# EAGLE design Solarduino_V0.4 (EAGLE 7.5.0)

## Sheet 1 of 2
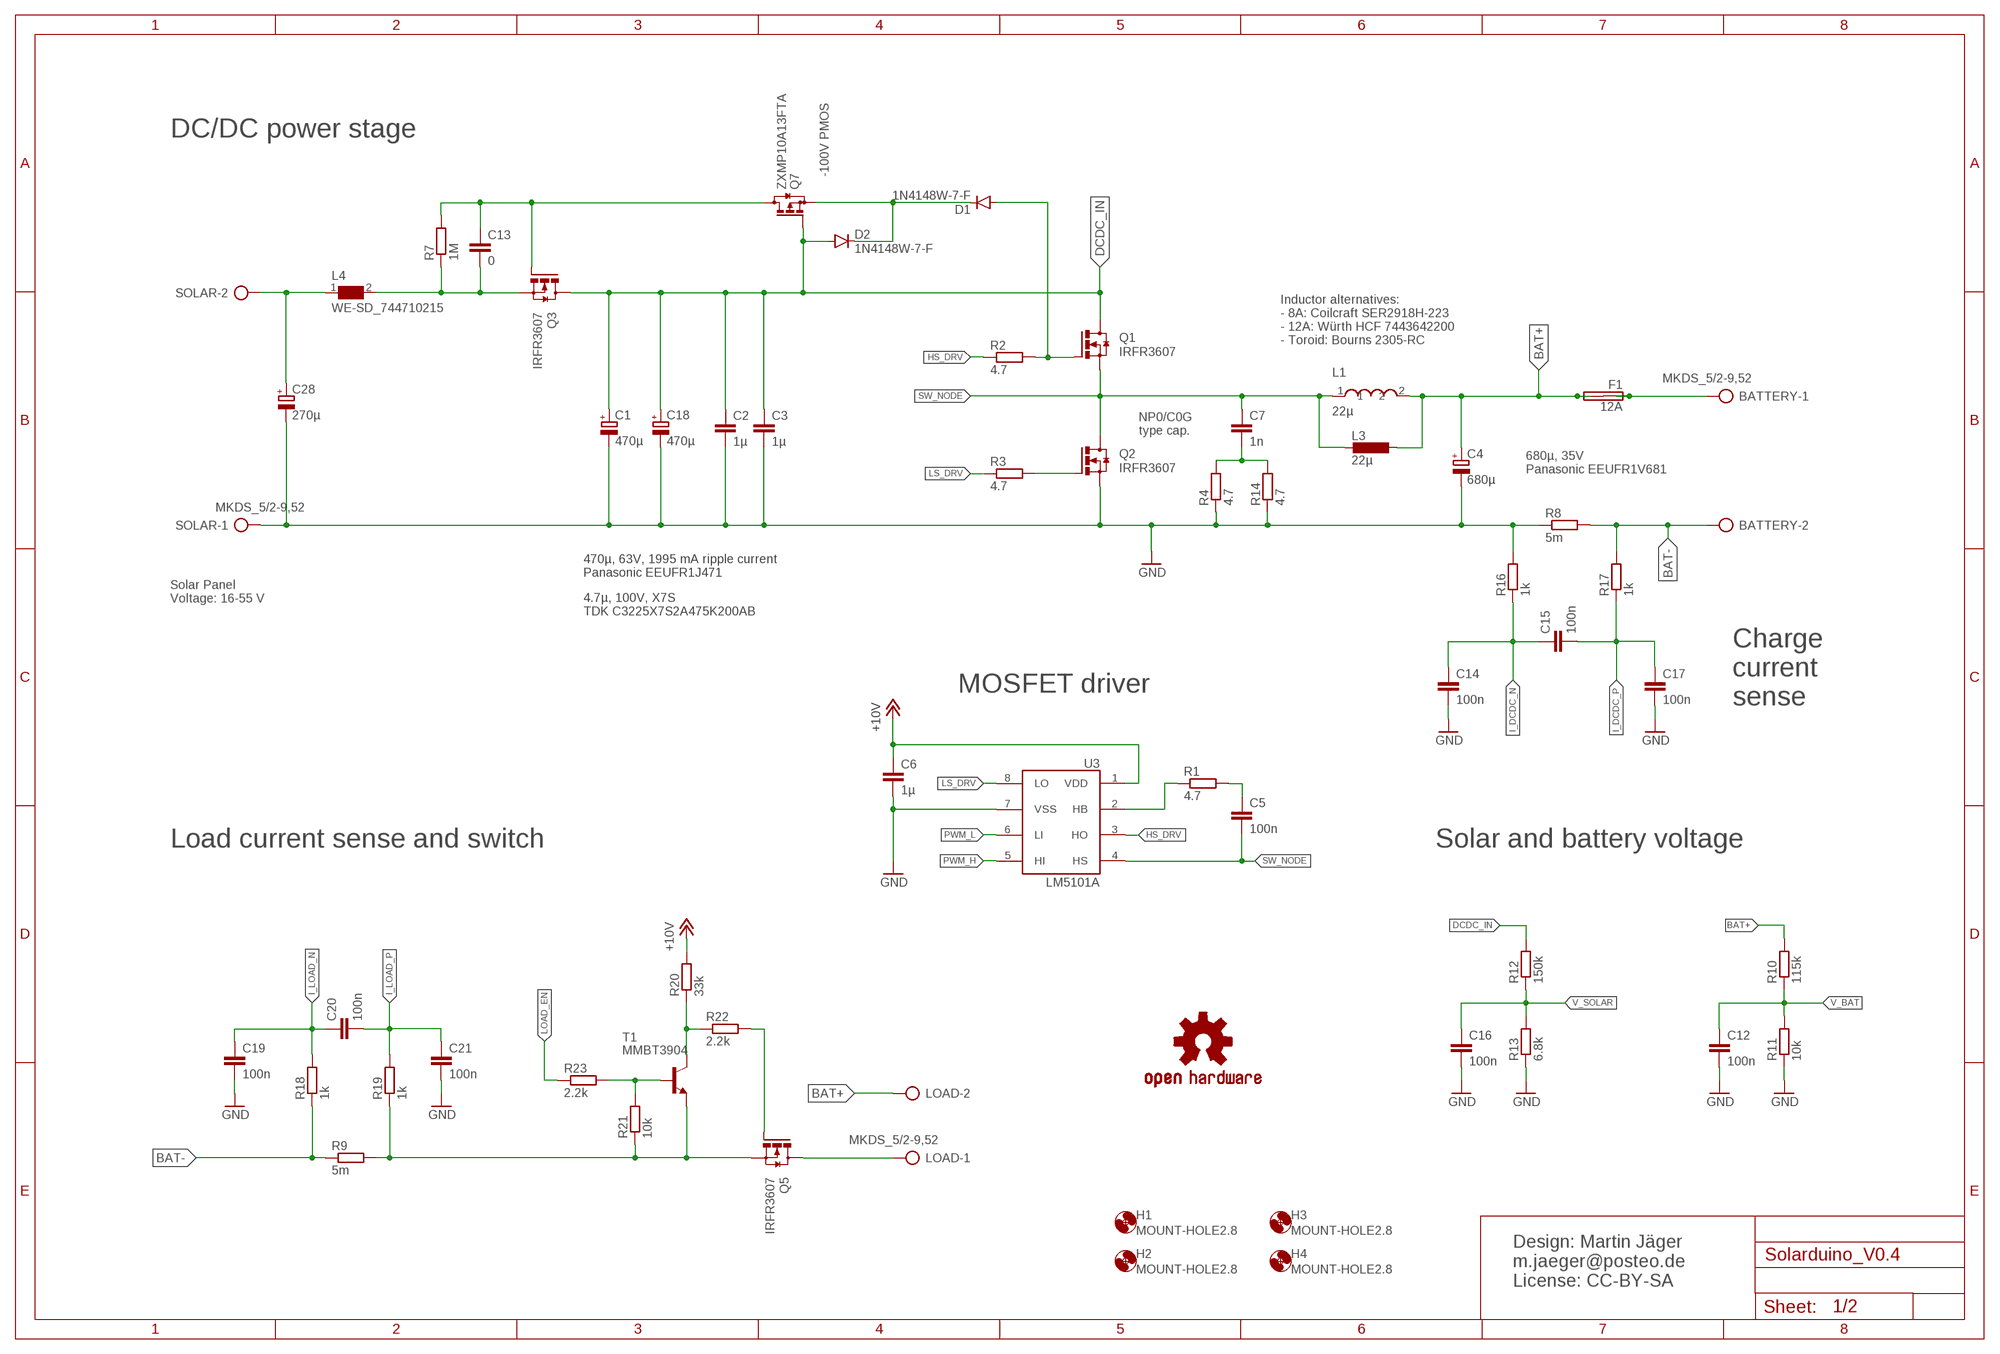
[diagram p0: schematic, sheet 1]

### Parts
BATTERY  MKDS_5/2-9,52  [MKDS_5/2-952]
C1  470µ  CPOL-EUE5-13  [E5-13]
C2  1µ  C-EUC0805  [C0805]
C3  1µ  C-EUC0805  [C0805]
C4  680µ  CPOL-EUE5-10.5  [E5-10,5]
C5  100n  C-EUC0603  [C0603]
C6  1µ  C-EUC0603  [C0603]
C7  1n  C-EUC0805  [C0805]
C12  100n  C-EUC0603  [C0603]
C13  0  C-EUC0603  [C0603]
C14  100n  C-EUC0603  [C0603]
C15  100n  C-EUC0603  [C0603]
C16  100n  C-EUC0603  [C0603]
C17  100n  C-EUC0603  [C0603]
C18  470µ  CPOL-EUE5-13  [E5-13]
C19  100n  C-EUC0603  [C0603]
C20  100n  C-EUC0603  [C0603]
C21  100n  C-EUC0603  [C0603]
C28  270µ  CPOL-EUE5-10.5  [E5-10,5]
D1  1N4148W-7-F  DIODESOD123  [SOD-123]
D2  1N4148W-7-F  DIODESOD123  [SOD-123]
F1  12A  FUSE_BLADE_STD  [BLADE_FUSE_STD]
H1  MOUNT-HOLE2.8  [2,8]
H2  MOUNT-HOLE2.8  [2,8]
H3  MOUNT-HOLE2.8  [2,8]
H4  MOUNT-HOLE2.8  [2,8]
L1  22µ  WE-HCF_2818_7443643300  [WE-HCF_2818_7443643300]
L3  22µ  L-BOURNS2300-H  [L-BOURNS-2300-H]
L4  WE-SD_744710215  [WE-SD_744710215]
LOAD  MKDS_5/2-9,52  [MKDS_5/2-952]
N1  OSHW-LOGOM  [OSHW-LOGO-M]
Q1  IRFR3607  MOSFET_N_DPAK  [DPAK]
Q2  IRFR3607  MOSFET_N_DPAK  [DPAK]
Q3  IRFR3607  MOSFET_N_DPAK  [DPAK]
Q5  IRFR3607  MOSFET_N_DPAK  [DPAK]
Q7  ZXMP10A13FTA  BSS84  [SOT23]
R1  4.7  R-EU_R0805  [R0805]
R2  4.7  R-EU_R0805  [R0805]
R3  4.7  R-EU_R0805  [R0805]
R4  4.7  R-EU_R1206  [R1206]
R7  1M  R-EU_R0603  [R0603]
R8  5m  R-EU_R2512  [R2512]
R9  5m  R-EU_R2512  [R2512]
R10  115k  R-EU_R0603  [R0603]
R11  10k  R-EU_R0603  [R0603]
R12  150k  R-EU_R0603  [R0603]
R13  6.8k  R-EU_R0603  [R0603]
R14  4.7  R-EU_R1206  [R1206]
R16  1k  R-EU_R0603  [R0603]
R17  1k  R-EU_R0603  [R0603]
R18  1k  R-EU_R0603  [R0603]
R19  1k  R-EU_R0603  [R0603]
R20  33k  R-EU_R0603  [R0603]
R21  10k  R-EU_R0603  [R0603]
R22  2.2k  R-EU_R0603  [R0603]
R23  2.2k  R-EU_R0603  [R0603]
SOLAR  MKDS_5/2-9,52  [MKDS_5/2-952]
T1  MMBT3904  MMBT3904LT1-NPN-SOT23-BEC  [SOT23-BEC]
U3  LM5101A  [SOIC-8-N]

### Nets
+10V [VIN]: C6.1 R20.2 U3.1(VDD) ; also sheet 2
BAT+ [VIN]: C4.+ F1.P$3(2A) F1.P$4(2B) L1.2 L3.P$1 LOAD.2 R10.2 ; also sheet 2
BAT-: BATTERY.2 R8.2 R9.1 R17.2 R18.1
DCDC_IN: C1.+ C2.1 C3.1 C18.+ D2.A Q1.4(D) Q3.4(D) Q7.1(G) R12.2
FUSE+ [VIN]: BATTERY.1 F1.P$1(1A) F1.P$2(1B)
GND: C1.- C2.2 C3.2 C4.- C6.2 C12.2 C14.2 C16.2 C17.2 C18.- C19.2 C21.2 C28.- Q2.3(S) R4.1 R8.1 R11.1 R13.1 R14.1 R16.2 SOLAR.1 U3.7(VSS) ; also sheet 2
HS_DRV: R2.1 U3.3(HO)
I_DCDC_N: C14.1 C15.1 R16.1 ; also sheet 2
I_DCDC_P: C15.2 C17.1 R17.1 ; also sheet 2
I_LOAD_N: C19.1 C20.1 R18.2 ; also sheet 2
I_LOAD_P: C20.2 C21.1 R19.2 ; also sheet 2
LC_OUT: C13.2 L4.2 Q3.3(S) R7.1
LOAD-: LOAD.1 Q5.4(D)
LOAD_EN: R23.1 ; also sheet 2
LOAD_G: Q5.1(G) R22.2
LS_DRV: R3.1 U3.8(LO)
N$1: R1.1 U3.2(HB)
N$2: C5.1 R1.2
N$4: D1.A Q1.1(G) R2.2
N$6 [power]: Q5.3(S) R9.2 R19.1 R21.1 T1.E
N$8: C13.1 Q3.1(G) Q7.3(D) R7.2
N$9: Q2.1(G) R3.2
N$10: D1.C D2.C Q7.2(S)
N$11: R20.1 R22.1 T1.C
N$12: C7.2 R4.2 R14.2
N$24: R21.2 R23.2 T1.B
PWM_H: U3.5(HI) ; also sheet 2
PWM_L: U3.6(LI) ; also sheet 2
SOLAR+: C28.+ L4.1 SOLAR.2
SW_NODE: C5.2 C7.1 L1.1 L3.P$2 Q1.3(S) Q2.4(D) U3.4(HS)
V_BAT: C12.1 R10.1 R11.2 ; also sheet 2
V_SOLAR: C16.1 R12.1 R13.2 ; also sheet 2

### Notes on the sheet
- DC/DC power stage
- -100V PMOS
- Inductor alternatives:
  - 8A: Coilcraft SER2918H-223
  - 12A: Würth HCF 7443642200
  - Toroid: Bourns 2305-RC
- NP0/C0G
  type cap.
- 680µ, 35V
  Panasonic EEUFR1V681
- 470µ, 63V, 1995 mA ripple current
  Panasonic EEUFR1J471
- Solar Panel
  Voltage: 16-55 V
- 4.7µ, 100V, X7S
  TDK C3225X7S2A475K200AB
- MOSFET driver
- Charge
  current
  sense
- Load current sense and switch | Solar and battery voltage
- Design: Martin Jäger
  m.jaeger@posteo.de
  License: CC-BY-SA

## Sheet 2 of 2
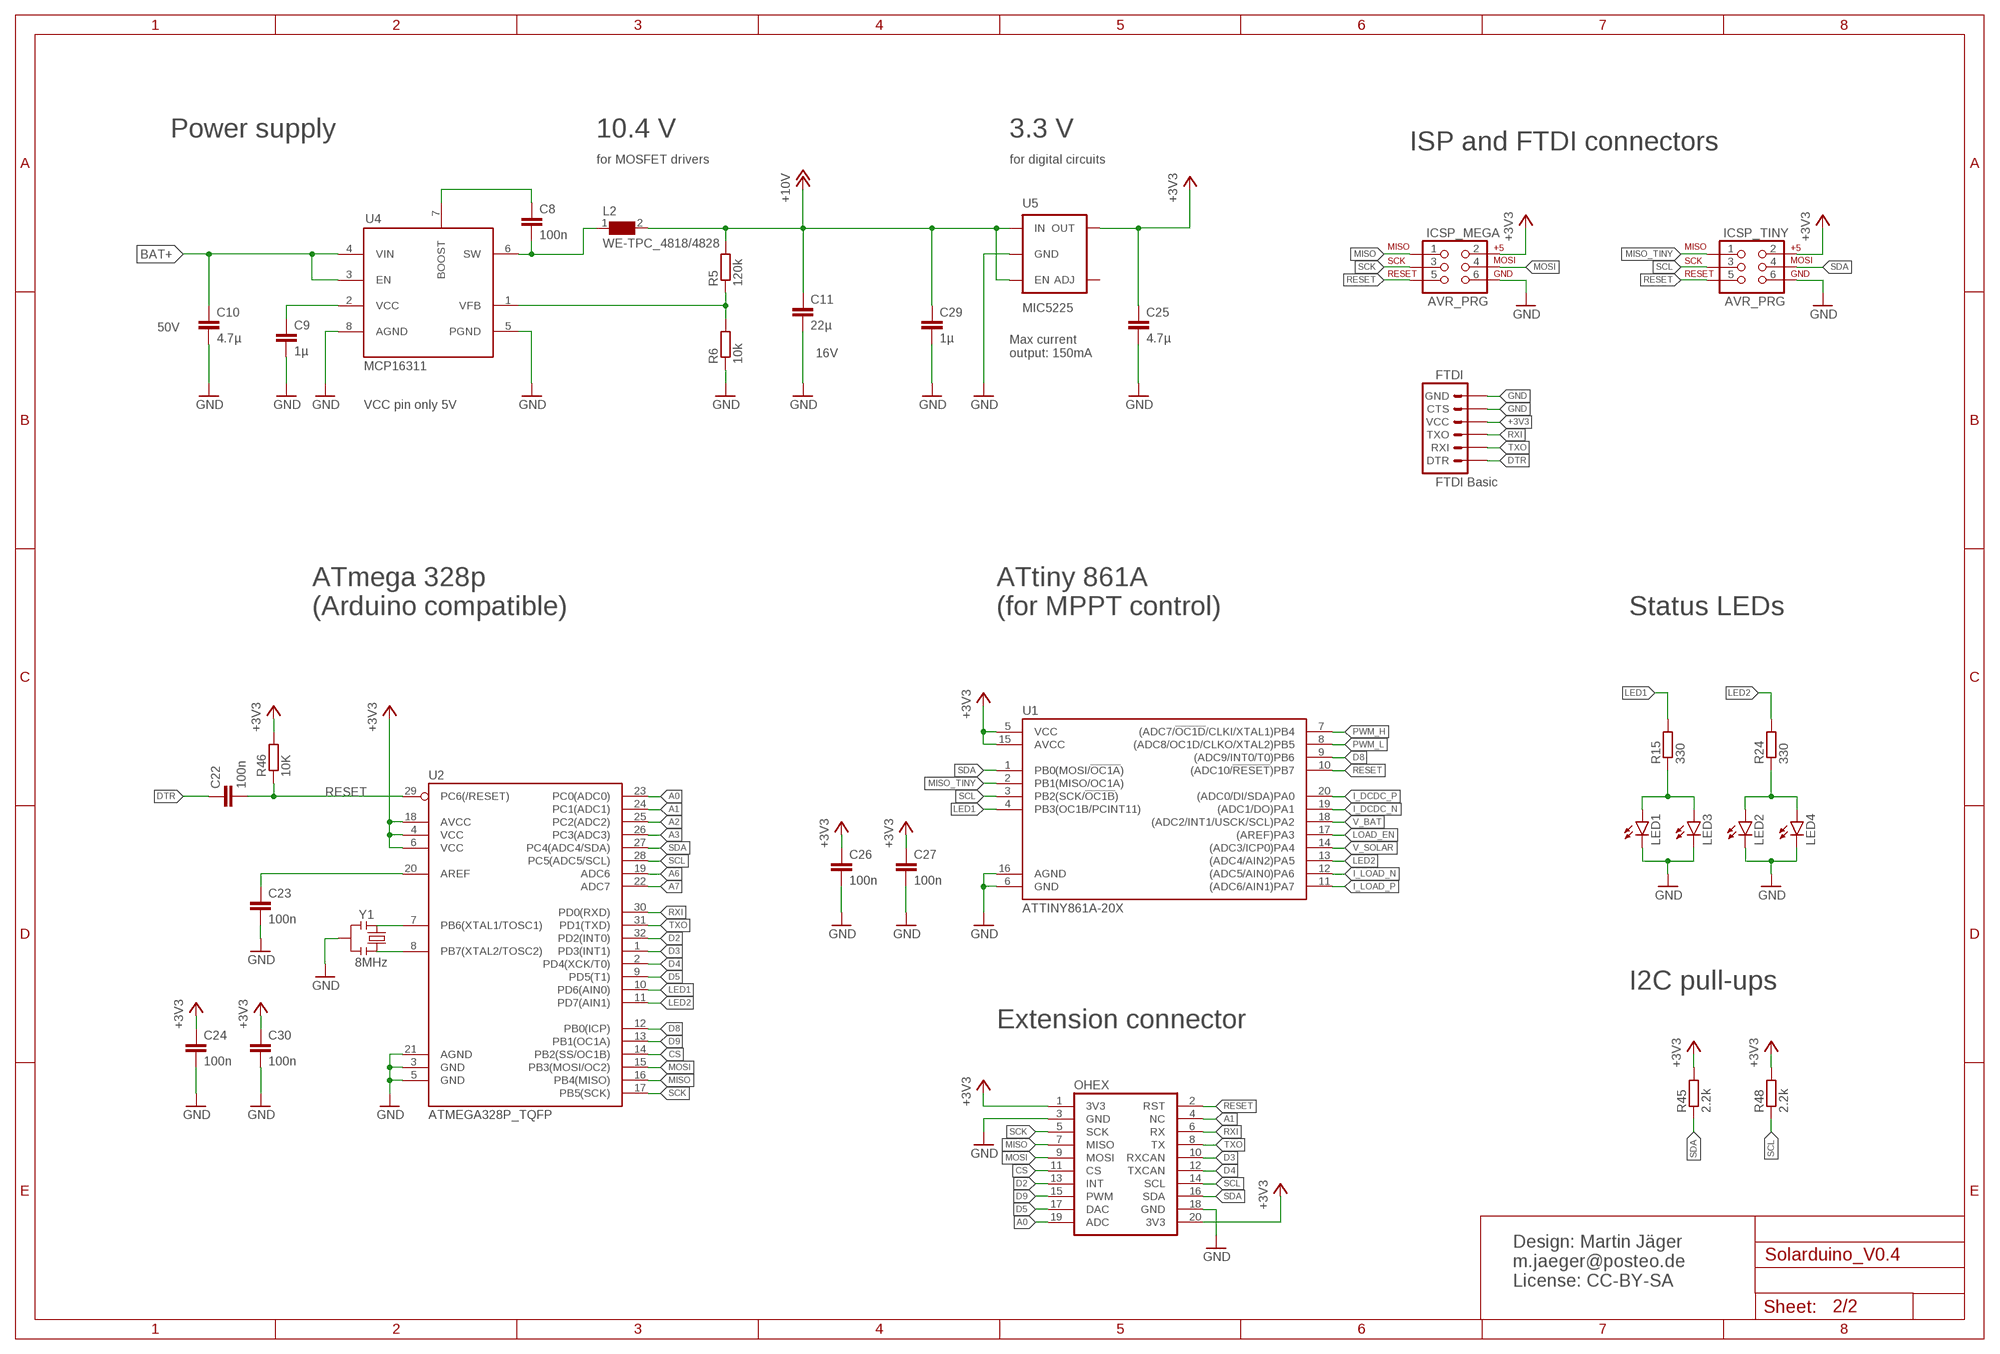
[diagram p1: schematic, sheet 2]

### Parts
C8  100n  C-EUC0603  [C0603]
C9  1µ  C-EUC0603  [C0603]
C10  4.7µ  C-EUC1210  [C1210]
C11  22µ  C-EUC1210  [C1210]
C22  100n  C-EUC0603  [C0603]
C23  100n  C-EUC0603  [C0603]
C24  100n  C-EUC0603  [C0603]
C25  4.7µ  C-EUC0603  [C0603]
C26  100n  C-EUC0603  [C0603]
C27  100n  C-EUC0603  [C0603]
C29  1µ  C-EUC0603  [C0603]
C30  100n  C-EUC0603  [C0603]
FTDI  FTDI Basic  ARDUINO_SERIAL_PROGRAMPTH  [1X06]
ICSP_MEGA  AVR_PRG  AVR_SPI_PRG_6PTH  [2X3]
ICSP_TINY  AVR_PRG  AVR_SPI_PRG_6PTH  [2X3]
L2  WE-TPC_4818/4828  [WE-TPC_4818/4828]
LED1  LED3MM  [LED3MM]
LED2  LED3MM  [LED3MM]
LED3  LED0603  [LED-0603]
LED4  LED0603  [LED-0603]
OHEX  OHEX  [OHEX_SMALL]
R5  120k  R-EU_R0603  [R0603]
R6  10k  R-EU_R0603  [R0603]
R15  330  R-EU_R0603  [R0603]
R24  330  R-EU_R0603  [R0603]
R45  2.2k  R-EU_R0603  [R0603]
R46  10K  R-EU_R0603  [R0603]
R48  2.2k  R-EU_R0603  [R0603]
U1  ATTINY861A-20X  [TSSOP20]
U2  ATMEGA328P_TQFP  ATMEGA328P-TQFP  [TQFP32-08]
U4  MCP16311  [MSOP8]
U5  MIC5225  V_REG_MIC5235  [SOT23-5]
Y1  8MHz  RESONATORSMD  [RESONATOR-SMD]

### Nets
+3V3: C24.1 C25.1 C26.1 C27.1 C30.1 FTDI.4(VCC) ICSP_MEGA.2 ICSP_TINY.2 OHEX.1(3V3) OHEX.20(3V3) R45.2 R46.2 R48.2 U1.5(VCC) U1.15(AVCC) U2.4(VCC) U2.6(VCC) U2.18(AVCC) U5.5(OUT)
+10V [VIN]: C11.1 C29.1 L2.2 R5.2 U5.1(IN) U5.3(EN) ; also sheet 1
A0: OHEX.19(ADC) U2.23(PC0(ADC0))
A1: OHEX.4(NC) U2.24(PC1(ADC1))
A2: U2.25(PC2(ADC2))
A3: U2.26(PC3(ADC3))
A6: U2.19(ADC6)
A7: U2.22(ADC7)
AREF: C23.1 U2.20(AREF)
BAT+ [VIN]: C10.1 U4.3(EN) U4.4(VIN) ; also sheet 1
CS: OHEX.11(CS) U2.14(PB2(SS/OC1B))
D2: OHEX.13(INT) U2.32(PD2(INT0))
D3: OHEX.10(RXCAN) U2.1(PD3(INT1))
D4: OHEX.12(TXCAN) U2.2(PD4(XCK/T0))
D5: OHEX.17(DAC) U2.9(PD5(T1))
D8: U1.9((ADC9/INT0/T0)PB6) U2.12(PB0(ICP))
D9: OHEX.15(PWM) U2.13(PB1(OC1A))
DTR: C22.1 FTDI.1(DTR)
GND: C9.2 C10.2 C11.2 C23.2 C24.2 C25.2 C26.2 C27.2 C29.2 C30.2 FTDI.5(CTS) FTDI.6(GND) ICSP_MEGA.6 ICSP_TINY.6 LED1.K(C) LED2.K(C) LED3.C LED4.C OHEX.3(GND) OHEX.18(GND) R6.1 U1.6(GND) U1.16(AGND) U2.3(GND) U2.5(GND) U2.21(AGND) U4.5(PGND) U4.8(AGND) U5.2(GND) Y1.2 ; also sheet 1
I_DCDC_N: U1.19((ADC1/DO)PA1) ; also sheet 1
I_DCDC_P: U1.20((ADC0/DI/SDA)PA0) ; also sheet 1
I_LOAD_N: U1.12((ADC5/AIN0)PA6) ; also sheet 1
I_LOAD_P: U1.11((ADC6/AIN1)PA7) ; also sheet 1
LED1: R15.2 U1.4(PB3(OC1B/PCINT11)) U2.10(PD6(AIN0))
LED2: R24.2 U1.13((ADC4/AIN2)PA5) U2.11(PD7(AIN1))
LOAD_EN: U1.17((AREF)PA3) ; also sheet 1
MISO: ICSP_MEGA.1 OHEX.7(MISO) U2.16(PB4(MISO))
MISO_TINY: ICSP_TINY.1 U1.2(PB1(MISO/OC1A))
MOSI: ICSP_MEGA.4 OHEX.9(MOSI) U2.15(PB3(MOSI/OC2))
N$13: C8.2 L2.1 U4.6(SW)
N$14: C8.1 U4.7(BOOST)
N$15: U2.7(PB6(XTAL1/TOSC1)) Y1.1
N$16: C9.1 U4.2(VCC)
N$17: U2.8(PB7(XTAL2/TOSC2)) Y1.3
N$22: R5.1 R6.2 U4.1(VFB)
N$43: LED1.A LED3.A R15.1
N$46: LED2.A LED4.A R24.1
PWM_H: U1.7((ADC7/!OC1D!/CLKI/XTAL1)PB4) ; also sheet 1
PWM_L: U1.8((ADC8/OC1D/CLKO/XTAL2)PB5) ; also sheet 1
RESET: C22.2 ICSP_MEGA.5 ICSP_TINY.5 OHEX.2(RST) R46.1 U1.10((ADC10/!RESET!)PB7) U2.29(PC6(/RESET))
RXI: FTDI.3(TXO) OHEX.6(RX) U2.30(PD0(RXD))
SCK: ICSP_MEGA.3 OHEX.5(SCK) U2.17(PB5(SCK))
SCL: ICSP_TINY.3 OHEX.14(SCL) R48.1 U1.3(PB2(SCK/!OC1B!)) U2.28(PC5(ADC5/SCL))
SDA: ICSP_TINY.4 OHEX.16(SDA) R45.1 U1.1(PB0(MOSI/!OC1A!)) U2.27(PC4(ADC4/SDA))
TXO: FTDI.2(RXI) OHEX.8(TX) U2.31(PD1(TXD))
V_BAT: U1.18((ADC2/INT1/USCK/SCL)PA2) ; also sheet 1
V_SOLAR: U1.14((ADC3/ICP0)PA4) ; also sheet 1
Unconnected: U5.4(ADJ)

### Notes on the sheet
- Power supply | 10.4 V | 3.3 V
- ISP and FTDI connectors
- for MOSFET drivers | for digital circuits
- 50V
- 16V
- Max current 
  output: 150mA
- VCC pin only 5V
- ATmega 328p
  (Arduino compatible)
- ATtiny 861A
  (for MPPT control)
- Status LEDs
- I2C pull-ups
- Extension connector
- Design: Martin Jäger
  m.jaeger@posteo.de
  License: CC-BY-SA

## Library data of the parts
BATTERY LOAD SOLAR = resolut:MKDS_5/2-: MKDS 5/2-6,35 Source: PHOENIX CONTACT; OC_FARNELL: unknown
C1 C18 = rcl:CPOL-EU: POLARIZED CAPACITOR, European symbol; MF: PANASONIC ELECTRONIC COMPONENTS; MPN: EEUFR1J331B; OC_FARNELL: 2079305
C2 C3 = rcl:C-EU: CAPACITOR, European symbol; MF: TDK; MPN: C3225X7S2A475K200AB; OC_FARNELL: 2211203
C4 C28 = rcl:CPOL-EU: POLARIZED CAPACITOR, European symbol; MF: PANASONIC ELECTRONIC COMPONENTS; MPN: EEUFR1E821B; OC_FARNELL: 2063075
C5-C17 C19-C24 C26 C27 C30 = rcl:C-EU: CAPACITOR, European symbol; MF: AVX; MPN: 08055C104KAT2A; OC_FARNELL: 499687
C25 = rcl:C-EU: CAPACITOR, European symbol; MF: AVX; MPN: 0805YC475KAT2A; OC_FARNELL: 1657937
C29 = rcl:C-EU: CAPACITOR, European symbol; MF: AVX; MPN: 08053C105KAT2A; OC_FARNELL: 1658877
D1 D2 = SparkFun-DiscreteSemi:DIODE: Diode These are standard reverse protection diodes and small signal diodes. SMA package can handle up to about 1A. SOD-323 can handle about 200mA. What the SOD-323 package when ordering, there are some mfgs out there that are 5-pin packages.
F1 = LibreSolar:FUSE: FUSE HOLDER 5 x 20 mm, SH contact, E1207 Buerklin 64G6061
FTDI = SparkFun:ARDUINO_SERIAL_PROGRAM; MF: MULTICOMP; MPN: 2212S-06SG-85; OC_FARNELL: 1593462
H1-H4 = holes:MOUNT-HOLE: MOUNTING HOLE with drill center marker
ICSP_MEGA ICSP_TINY = SparkFun-Connectors:AVR_SPI_PRG_6: AVR ISP 6 Pin This is the reduced ISP connector for AVR programming. Common on Arduino. This footprint will take up less PCB space and can be used with a 10-pin to 6-pin adapter such as SKU: BOB-08508 **Special note about "TEST_POINT" package. The stop mask is on the top side, so if you want your programming test points to be on the bottom of your board, make sure to place this package on the bottom side of the board. This also ensure that the orientation to program from the bottom side will be correct.; OC_FARNELL: unknown
L1 = PowerMagnetics:WE-HCF_2818_7443643300: SMD High Current Inductor -Saturation current up to 75A -Very low core losses(MnZn) -Magnetically shielded -Operating temprature:-40°Cto 125°C -Current capability up to 32A --Storage inductor for high efficiency DC/DC converters --Single and polyphase buck converters --Filter for audio applications --Optimized for high current boost applications <http://katalog.we-online.de/media/images/eisos/IndHCF_pf2.jpg> Details see: http://katalog.we-online.de/en/pbs/WE-HCF Created by Dan Xu 2014-07-14 2014 (C) Würth Elektronik; MF: COILCRAFT; MPN: SER2918H-223KL; OC_FARNELL: 2288918
L2 = PowerMagnetics:WE-TPC: Shielded Tiny Power Inductor WE-TPC - Extremely flat power inductor - High current capability - High reliability and perfect soldering characteristics because of integrated soldering pad - magnetically shielded -- Portable power like PDA, digital camera, PCMICA-cards and displays -- DC/DC-converter -- Recommended for switching regulator IC's from Linear Technology, National Semiconductor, Texas Instruments and Fairchild Semiconductor <http://katalog.we-online.de/media/images/eisos/IndTPC_pf2.jpg> Details see: http://katalog.we-online.de/en/pbs/WE-TPC? Updated by Dan Xu 2014-07-11 2014 (C) Würth Elektronik
L3 = LibreSolar:L-BOURNS2300: Bourns High Current Toroid Inductor (2300 Series) Hole fits for largest wire diameter, e.g. Part Number 2305-RC: 22 uH, 16.4 A
L4 = PowerMagnetics:WE-SD: Leaded Wire Wound Rodcore Inductor WE-SD HIGH CURRENT - Rated Current up to 20 A - Inductance is independent from rated DC current - Mechanical dimensions can be adjusted on customer request - High mechanical stability -- Swirching regulators -- Motors -- Power amplifiers -- Power supplies -- Especially designed for automotive industry -- Broadband filtering <http://katalog.we-online.de/media/images/eisos/IndSD_pf2.jpg.jpg> Details see: http://katalog.we-online.de/en/pbs/WE-SD? Updated by Dan Xu 2014-07-11 2014 (C) Würth Elektronik
LED1-LED4 = SparkFun-LED:LED: LEDs Standard schematic elements and footprints for 5mm, 3mm, 1206, and 0603 sized LEDs. 5mm - Spark Fun Electronics SKU : COM-00529 (and others); OC_FARNELL: unknown
N1 = resolut:OSHW-LOGO: Open Source Hardware Logo This logo indicates the piece of hardware it is found on incorporates a OSHW license and/or adheres to the definition of open source hardware found here: http://freedomdefined.org/OSHW; OC_FARNELL: unknown
OHEX = LibreSolar:OHEX: PIN HEADER
Q1-Q3 Q5 = LibreSolar:MOSFET_N
Q7 = transistor-small-signal:BSS84: P-CHANNEL MOS FET; MF: MULTICOMP; MPN: BSS84-7-F; OC_FARNELL: 2306397
R1 R5 R6 R45 R48 = rcl:R-EU_: RESISTOR, European symbol; MF: BOURNS; MPN: CR0805-FX-1001ELF; OC_FARNELL: 2008380
R2 R3 R7 R22 R23 = rcl:R-EU_: RESISTOR, European symbol; MF: BOURNS; MPN: CR0805-FX-1004ELF.; OC_FARNELL: 1795166
R4 R14 R16-R21 = rcl:R-EU_: RESISTOR, European symbol; MF: BOURNS; MPN: CRM2010-JW-2R2ELF; OC_FARNELL: 1865253
R8 R9 = rcl:R-EU_: RESISTOR, European symbol; MF: BOURNS; MPN: CRF2512-FX-R005ELF; OC_FARNELL: 2008327
R10 R12 R13 = rcl:R-EU_: RESISTOR, European symbol; MF: PANASONIC ELECTRONIC COMPONENTS; MPN: ERA6AEB104V; OC_FARNELL: 1577686
R11 = rcl:R-EU_: RESISTOR, European symbol; MF: PANASONIC ELECTRONIC COMPONENTS; MPN: ERA6AEB682V; OC_FARNELL: 1577671
R15 R24 = rcl:R-EU_: RESISTOR, European symbol; MF: MULTICOMP; MPN: MCMR06X1001FTL; OC_FARNELL: 2073348
R46 = rcl:R-EU_: RESISTOR, European symbol; MF: BOURNS; MPN: CR0805-FX-1002ELF; OC_FARNELL: 1612522
T1 = transistor:*-NPN-: NPN Transistror BF959 corrected 2008.03.06
U1 = LibreSolar:ATTINY861A: Atmel 20-pin 2/4/8 kB flash uC
U2 = LibreSolar:ATMEGA328P; PROD_ID: IC-09069
U3 = LibreSolar:LM5101A
U4 = LibreSolar:MCP16311: 30V Input, 1A Output, High-Efficiency, Integrated Synchronous Switch Step-Down Regulator
U5 = SparkFun-PowerIC:V_REG_MIC5235; MF: MICROCHIP; MPN: MIC5225-3.3YM5-TR; OC_FARNELL: 2510262
Y1 = Testing:RESONATOR: Resonator Small SMD resonator. This is the itty bitty 10/20MHz resonators with built in caps. CSTCE10M0G55 and CSTCE20M0V53. Footprint for SMD has been used in SFE production for years, and does work okay. 1:1 is an attempt to get larger fillets on the sides so it will be easier to inspect these solders in our AOI machine. The pads have been minimized to match the actual metal under the resonator. To see this relation, it includes an image import of the bottom side of the component. Imported to scale on layer 200.; MF: MURATA; MPN: CSTCE8M00G55-R0; OC_FARNELL: 2443270

## Net classes
0 default: width 0.203 mm, drill 0.3 mm, clearance 0.152 mm
1 power: width 0.203 mm, drill 0.3 mm, clearance 0.152 mm
2 VIN: width 0.203 mm, drill 0.3 mm, clearance 0.152 mm

## Board
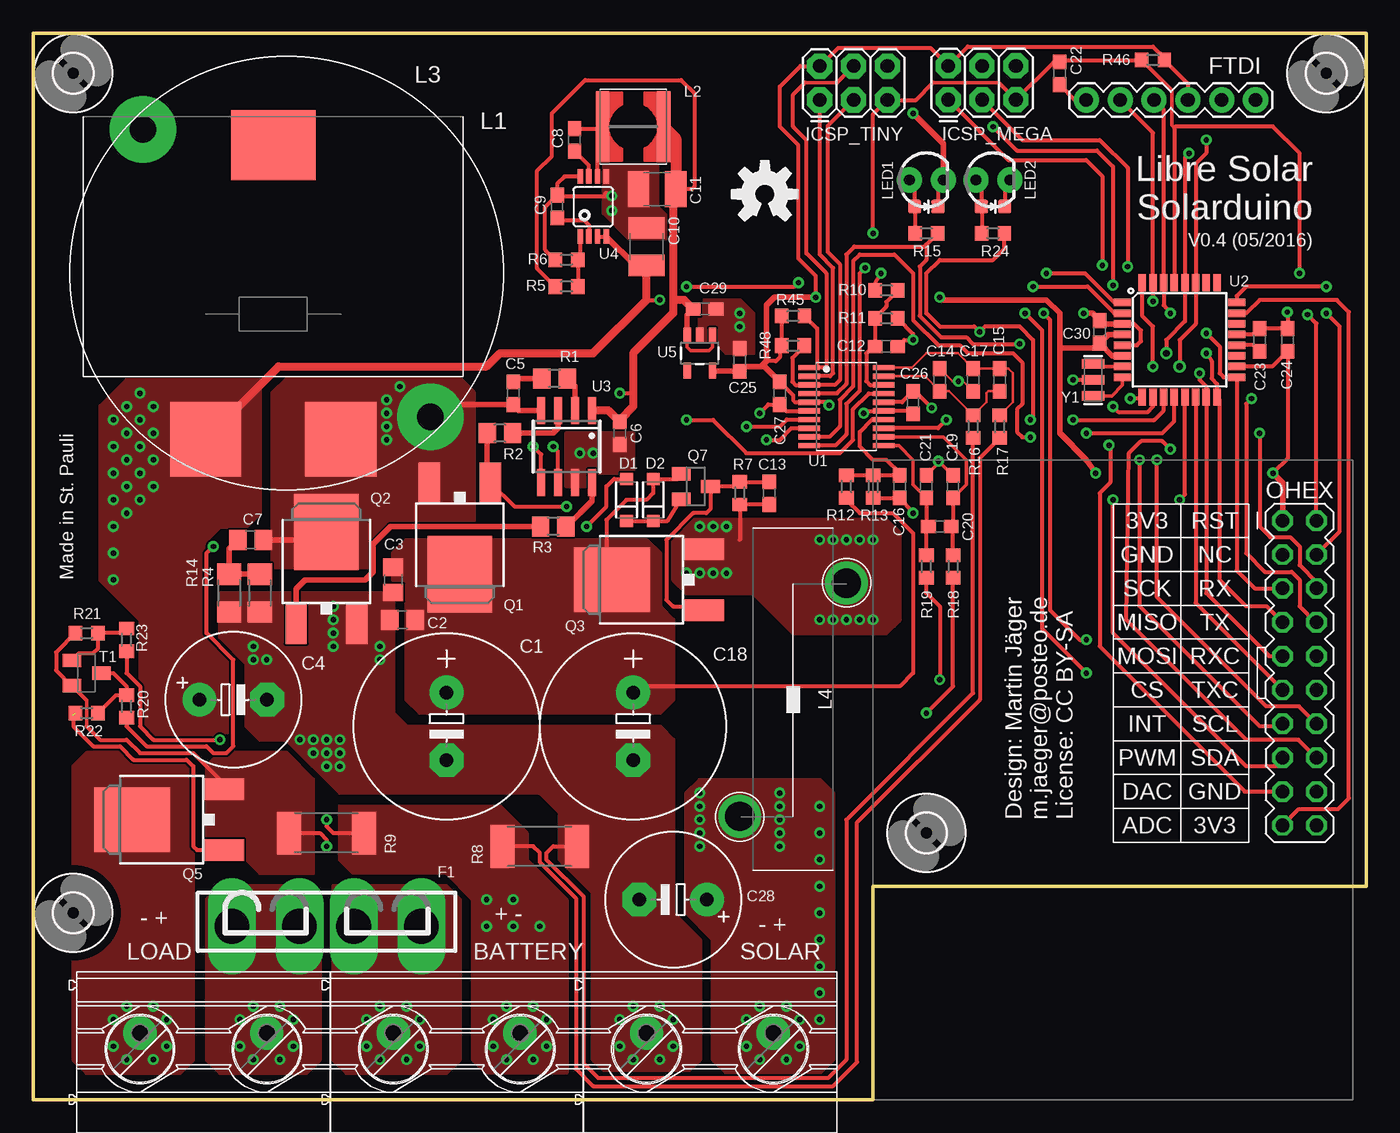
[diagram p2: board, top side]
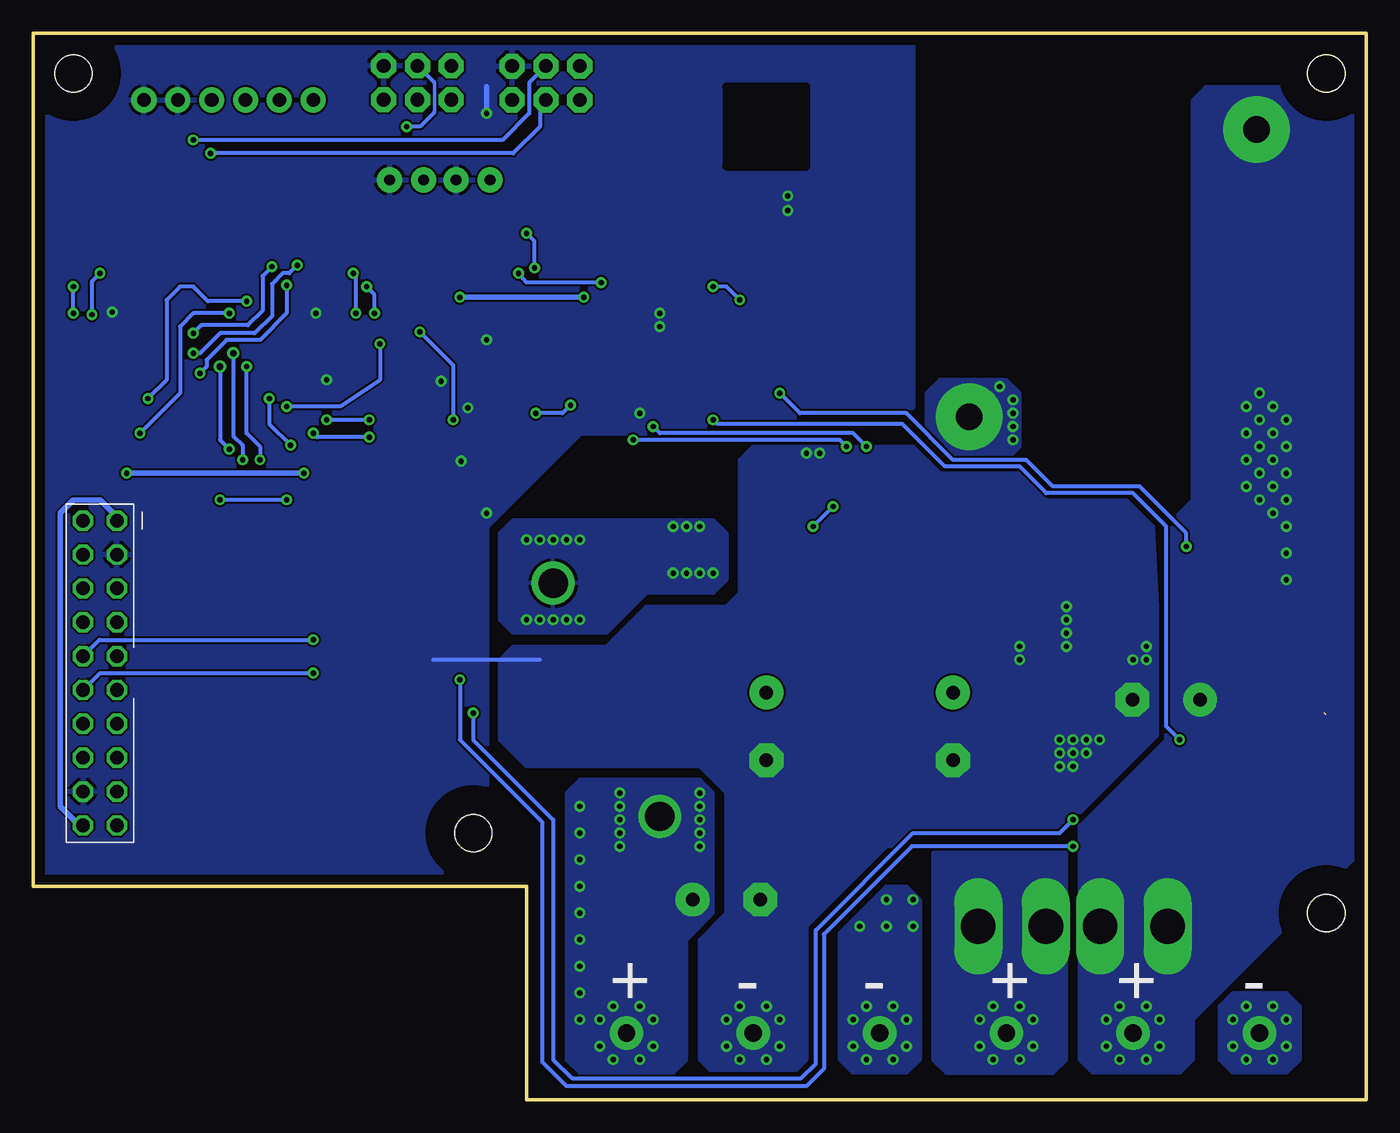
[diagram p3: board, bottom side, seen from below]

Size 100 x 80 mm. Coordinates in mm from the lower left corner, seen from the top.
Outline: 100,80 0,80 0,0 63,0 63,16 100,16 100,80
Copper layers (1*16): Top 0.035mm / dielectric 1.5mm / Bottom 0.035mm
Design rules "default *": minimum track width 8mil, minimum drill 0.3mm, track to track 6mil, track to pad 6mil, pad to pad 6mil, via to via 6mil, smd to smd 6mil, copper to edge 30mil, drill to drill 8mil, minimum pad ring 10mil, minimum via ring 8mil, stop-mask expansion 4mil, vias tented up to drill 0mil, thermal gap 10mil
bRestrict: area 42,70 to 48,76

### Footprints (pad centres in the part's own frame; a part is rotated, then mirrored left to right if it is on the bottom)
MKDS_5/2-952 = drill 1.3 pad 2.5: 1 0,0; 2 9.5,0
E5-13 = drill 1.016 pad 2.54: + -2.54,0 | drill 1.016 pad 2.54 octagon: - 2.54,0
C0805 = smd 1.3 x 1.5: 1 -0.95,0; 2 0.95,0
E5-10,5 = drill 1.016 pad 2.54: + -2.54,0 | drill 1.016 pad 2.54 octagon: - 2.54,0
C0603 = smd 1.1 x 1: 1 -0.85,0; 2 0.85,0
C1210 = smd 1.6 x 2.7: 1 -1.4,0; 2 1.4,0
SOD-123 = smd 0.9 x 0.95: A 1.575,0; C -1.575,0
BLADE_FUSE_STD = drill 2.6 pad 3.1 long: P$1 -7.112,0; P$2 -2.032,0; P$3 2.032,0; P$4 7.112,0
1X06 = drill 1.016 pad 1.88: 1 0,0; 2 2.54,0; 3 5.08,0; 4 7.62,0; 5 10.16,0; 6 12.7,0
2,8 = hole 2.8: 0,0
2X3 = drill 1.016 pad 1.88 octagon: 1 0,0; 2 0,2.54; 3 2.54,0; 4 2.54,2.54; 5 5.08,0; 6 5.08,2.54
WE-HCF_2818_7443643300 = smd 5.33 x 5.59: 1 -5.075,14.465; 2 5.075,14.465 | smd 6.35 x 5.28: 3 0,-7.61
WE-TPC_4818/4828 = smd 1 x 5.3: 1 -2.3,0; 2 2.3,0
L-BOURNS-2300-H = drill 2 pad 5: P$1 -15.24,0; P$2 15.24,0
WE-SD_744710215 = drill 2.2: 1 -8.75,4; 2 8.75,-4
LED3MM = drill 0.813 pad 1.88: A -1.27,0; K 1.27,0
LED-0603 = smd 1 x 1: A 0,-0.877; C 0,0.877
OHEX_SMALL = drill 1.016 octagon: 1 -1.27,11.43; 2 1.27,11.43; 3 -1.27,8.89; 4 1.27,8.89; 5 -1.27,6.35; 6 1.27,6.35; 7 -1.27,3.81; 8 1.27,3.81; 9 -1.27,1.27; 10 1.27,1.27; 11 -1.27,-1.27; 12 1.27,-1.27; 13 -1.27,-3.81; 14 1.27,-3.81; 15 -1.27,-6.35; 16 1.27,-6.35; 17 -1.27,-8.89; 18 1.27,-8.89; 19 -1.27,-11.43; 20 1.27,-11.43
DPAK = smd 1.6 x 3: 1 -2.28,-5.31; 3 2.28,-5.31 | smd 4.826 x 5.715: 4 0,1.588
SOT23 = smd 1 x 1.4: 1 -0.95,-1.1; 2 0.95,-1.1; 3 0,1.1
R0805 = smd 1.3 x 1.5: 1 -0.95,0; 2 0.95,0
R1206 = smd 1.6 x 1.803: 1 -1.422,0; 2 1.422,0
R0603 = smd 1 x 1.1: 1 -0.85,0; 2 0.85,0
R2512 = smd 1.8 x 3.2: 1 -2.8,0; 2 2.8,0
SOT23-BEC = smd 1 x 1.4: B -0.95,-1.1; C 0,1.1; E 0.95,-1.1
TSSOP20 = smd 1.6 x 0.4: 1 -2.8,2.925; 2 -2.8,2.275; 3 -2.8,1.625; 4 -2.8,0.975; 5 -2.8,0.325; 6 -2.8,-0.325; 7 -2.8,-0.975; 8 -2.8,-1.625; 9 -2.8,-2.275; 10 -2.8,-2.925; 11 2.8,-2.925; 12 2.8,-2.275; 13 2.8,-1.625; 14 2.8,-0.975; 15 2.8,-0.325; 16 2.8,0.325; 17 2.8,0.975; 18 2.8,1.625; 19 2.8,2.275; 20 2.8,2.925
TQFP32-08 = smd 1.27 x 0.559: 1 -4.293,2.8; 2 -4.293,2; 3 -4.293,1.2; 4 -4.293,0.4; 5 -4.293,-0.4; 6 -4.293,-1.2; 7 -4.293,-2; 8 -4.293,-2.8; 17 4.293,-2.8; 18 4.293,-2; 19 4.293,-1.2; 20 4.293,-0.4; 21 4.293,0.4; 22 4.293,1.2; 23 4.293,2; 24 4.293,2.8 | smd 0.559 x 1.27: 9 -2.8,-4.293; 10 -2,-4.293; 11 -1.2,-4.293; 12 -0.4,-4.293; 13 0.4,-4.293; 14 1.2,-4.293; 15 2,-4.293; 16 2.8,-4.293; 25 2.8,4.293; 26 2,4.293; 27 1.2,4.293; 28 0.4,4.293; 29 -0.4,4.293; 30 -1.2,4.293; 31 -2,4.293; 32 -2.8,4.293
SOIC-8-N = smd 0.6 x 2: 1 -1.905,-2.7; 2 -0.635,-2.7; 3 0.635,-2.7; 4 1.905,-2.7; 5 1.905,2.7; 6 0.635,2.7; 7 -0.635,2.7; 8 -1.905,2.7
MSOP8 = smd 0.4 x 1.1: 1 -0.975,-2.25; 2 -0.325,-2.25; 3 0.325,-2.25; 4 0.975,-2.25; 5 0.975,2.25; 6 0.325,2.25; 7 -0.325,2.25; 8 -0.975,2.25
SOT23-5 = smd 0.55 x 1.2: 1 -0.95,-1.3; 2 0,-1.3; 3 0.95,-1.3; 4 0.95,1.3; 5 -0.95,1.3
RESONATOR-SMD = smd 0.7 x 1.7: 1 -1.2,0; 2 0,0; 3 1.2,0

### Placement (x,y rotation side)
BATTERY  27,5 0 top
C1  31,28 270 top
C2  27.7,36 180 top
C3  27,39 270 top
C4  15,30 0 top
C5  36,53 270 top
C6  44,50 270 top
C7  16.3,42 180 top
C8  40.6,72 90 top
C9  39.3,67 90 top
C10  46,64 90 top
C11  46.8,68.3 180 top
C12  64,56.5 0 top
C13  55.2,45.5 270 top
C14  68,54 90 top
C15  72.5,54 90 top
C16  65,46 270 top
C17  70.5,54 270 top
C18  45,28 270 top
C19  69,46 90 top
C20  68,43 180 top
C21  67,46 90 top
C22  77,77 90 top
C23  92,57 90 top
C24  94.1,57 90 top
C25  53,55.5 90 top
C26  66,52.3 90 top
C27  56,53 270 top
C28  48,15 180 top
C29  50.37,59.31 0 top
C30  80,57.6 90 top
D1  44.5,45 90 top
D2  46.5,45 90 top
F1  22,13 180 top
FTDI  79,75 0 top
H1  3,14 0 top
H2  3,77 0 top
H3  97,77 0 top
H4  67,20 0 top
ICSP_MEGA  68.64,75.02 0 top
ICSP_TINY  59,75 0 top
L1  18,64 180 top
L2  45,73 0 top
L3  19,62 315 top
L4  57,30 90 top
LED1  67,69 0 top
LED2  72,69 0 top
LED3  67,67 270 top
LED4  72,67 270 top
LOAD  8,5 0 top
N1  54.88,67.93 0 top
OHEX  95,32 0 top
Q1  32,41 180 top
Q2  22,41 0 top
Q3  45,39 90 top
Q5  9,21 90 top
Q7  49.7,46 270 top
R1  39.1,54.1 180 top
R2  35,50 180 top
R3  39,43 180 top
R4  17,38 90 top
R5  40,61 180 top
R6  40,63 0 top
R7  53,45.5 90 top
R8  38,19 180 top
R9  22,20 180 top
R10  64,60.7 180 top
R11  64,58.6 180 top
R12  61,46 270 top
R13  63,46 90 top
R14  14.7,38 90 top
R15  67,65 0 top
R16  70.5,50.5 270 top
R17  72.5,50.5 270 top
R18  69,40 90 top
R19  67,40 90 top
R20  7,29.5 270 top
R21  4,35 0 top
R22  4,29 180 top
R23  7,34.5 90 top
R24  72,65 0 top
R45  57,58.8 180 top
R46  84,78 0 top
R48  57,56.56 180 top
SOLAR  46,5 0 top
T1  4,32 270 top
U1  61,52 0 top
U2  86,57 0 top
U3  40,49 180 top
U4  42,67 0 top
U5  50,56 180 top
Y1  79.5,54 270 top

### Tracks (layer width: path | path; a pad name or v marks a point on that pad's centre or on a via)
+3V3  (via drill 0.4)
  Top 0.305: C27.1 57,52.85 57,52.5 57.17,52.33 U1.5 59.48,52.33 v59.7,52.1 | v62.3,51.5 62.48,51.67 U1.15 65.78,51.67 C26.1 | 55,55.4 55.7,55.4 56,55.7 56,56.42 R48.2 R45.2 | v58.7,60.2 58.7,61.8 57.4,63.1 57.4,71.6 56,73 56,76 57.54,77.54 ICSP_TINY.2 59.04,77.54 60.4,78.9 67.3,78.9 ICSP_MEGA.2 68.66,77.56 70.1,79 84,79 84.85,78.15 R46.2 86.62,76.23 FTDI.4 | U2.18 92.95,55 C24.1 94.1,48.1 v93,47
  Top 0.406: U5.5 51,54.65 C25.1 53.35,55 54.6,55 | 54.6,55 55,55.4 55,59.6 55.6,60.2 v58.7,60.2 | C27.1 54.85,55 54.6,55 | v68,60.2 68,60 76,60 77,59 77,56.4 | 77,56.4 79.55,56.4 C30.1 | OHEX.1 93.73,46.27 v93,47 | v79.7,47 79,48 77,50 77,56.4 | U2.4 80.65,57.4 C30.1 | U2.6 80.95,55.8 C30.1
  Bottom 0.305: v59.7,52.1 60.3,51.5 v62.3,51.5
  Bottom 0.406: v58.7,60.2 v68,60.2 | v93,47 v79.7,47 | OHEX.1 93.73,43.73 95,45 97,45 98,44 98,22 96.57,20.57 OHEX.20
+10V  (via drill 0.4)
  Top 0.254: U5.1 50.95,56.45 50.7,56.2 49.3,56.2 49.05,56.45 U5.3
  Top 0.305: 48.3,72 48.2,72.1 | R5.2 37.8,62.35 37.8,69.7 38.9,70.8 38.9,74 41.4,76.5 48.6,76.5 49.6,75.5 49.6,68.5 49.4,68.3 C11.1 | R20.2 7,28 8.5,26.5 13,26.5 13.5,26 14.5,26 15,26.5 15,33 13,35 13,41 v13.5,41.5 | v44,53 45,53
  Top 0.406: U5.3 49.05,58.84 C29.1 | C11.1 48,68.1 | 44,51 C6.1
  Top 0.61: C6.1 43.15,51.7 U3.1 | 48,68.1 48,60 | 48,60 48,59 45,56 45,53 45,52 44,51 | C29.1 48.83,60 48,60
  Top 0.813: L2.2 48.2,72.1 C11.1
  Bottom 0.305: v13.5,41.5 13.5,42.5 17,46 23.5,46 25.5,48 31,48 34.5,51.5 42.5,51.5 v44,53
A0
  Top 0.305: OHEX.19 94.96,21.8 97.9,21.8 98.7,22.6 98.7,59.1 97.8,60 92,60 91,59 U2.23
A1  (via drill 0.4)
  Top 0.305: OHEX.4 98,42.62 98,58 v97,59 | v97,61 91,61 90.29,60.29 U2.24
  Bottom 0.305: v97,59 v97,61
AREF
  Top 0.305: C23.1 91.55,56.6 U2.20
BAT+  (via drill 0.4)
  Top 0.305: U4.3 U4.4 | 46,60 v47,60 | v49,61 57.1,61 v57.4,61.3 | v63.6,62 63,60.95 R10.2
  Top 0.406: U4.4 45.12,62.6 C10.1
  Top 0.61: L1.2 18.39,55 34,55 35,56 42,56 46,60 C10.1
  Bottom 0.305: v47,60 48,61 v49,61 | v57.4,61.3 63,61.3 v63.6,62
  other vias: 16.5,7 15.5,6 15.5,4 16.5,3 18.5,3 19.5,4 19.5,6 18.5,7 6,49 6,47 6,45 6,51 6,43 6,41 6,39 8,51 8,49 7,50 7,48 7,46 7,52 8,53 8,47 9,46 9,48 9,50 9,52 7,44 8,45
  pour Top (no thermals): 17,54 7,54 5,52 5,39 8,36 8,28 9,27 14,27 15,28 15,33 13,35 13,42 14,43 16,43 17,44
  pour Bottom (no thermals): 14,2 20.5,2 21.5,3 21.5,20.5 15,27 15,43 13,45 13,75 12,76 1,76 1,18 13,6 13,3
  pour Top (no thermals): 14,2 20.5,2 21.5,3 21.5,15 20.5,16 14,16 13,15 13,3
BAT-  (via drill 0.4)
  Top 0.305: R8.2 37.5,19 38,18.5 38,17.8 40.7,15.1 40.7,2.3 42,1 60,1 61.8,2.8 61.8,20.8 71,30 71,48.15 R17.2 | v22,21 22,20.5 22.5,20 R9.1 | v67,29 69,31 R18.1
  Bottom 0.305: v22,21 23,20 34,20 41.3,12.7 41.3,2.7 42.4,1.6 59.6,1.6 61,3 61,21 67,27 v67,29
  other vias: 35.5,7 34.5,6 34.5,4 37.5,3 35.5,3 38.5,4 38.5,6 37.5,7 34,13 36,13 36,15 34,15 38,13
  pour Top (no thermals): 33,3 33,15 31,17 24,17 23,18 23,22 35,22 37,20 37,18 40,15 40,2 34,2
  pour Bottom (no thermals): 33.5,3 34.5,2 38.5,2 39.5,3 39.5,12.5 36,16 34.5,16 33.5,15
CS
  Top 0.305: U2.14 87.2,37.26 OHEX.11
D2  (via drill 0.4)
  Top 0.305: v84,55 84,58 83.2,58.8 U2.32 | OHEX.13 93.54,28 92,28 83,37 v83,48
  Bottom 0.305: v84,55 84,50 83,49 v83,48
D3  (via drill 0.4)
  Top 0.305: U2.1 81.1,59.8 78.9,62 v76,62 | v75.8,59 76.3,58.5 76.3,36.7 78.5,34.5 v79,34.5
  Bottom 0.305: OHEX.10 95.04,34.5 v79,34.5 | v75.8,59 75.8,61.8 v76,62
D4  (via drill 0.4)
  Top 0.305: U2.2 81.1,59 79.1,61 v75,61 | v79,32 75.7,35.3 75.7,57.7 v74.4,59
  Bottom 0.305: OHEX.12 95,32 v79,32 | v74.4,59 74.4,60.4 v75,61
D5  (via drill 0.4)
  Top 0.305: U2.9 83.09,52.6 v82.3,52.6 | v80.7,49.1 80.8,49 80.8,46.3 80,45.5 80,34 90.89,23.11 OHEX.17
  Bottom 0.305: v82.3,52.6 82.3,50.7 v80.7,49.1
D8  (via drill 0.4)
  Top 0.305: U1.9 59.73,49.73 60.5,50.5 60.5,52.5 61.5,53.5 61.5,62.9 62,63.4 64.6,63.4 66,62 66,58.5 67.9,56.6 69.5,56.6 70.1,56 73.5,56 74.2,55.3 74.2,52.2 73.8,51.8 73.8,50.1 74.2,49.7 v74.8,49.7 | v79,50 84.7,50 85.6,50.9 U2.12
  Bottom 0.305: v74.8,49.7 78.7,49.7 v79,50
D9  (via drill 0.4)
  Top 0.305: OHEX.15 93.38,25 91,25 81,35 v81,45 | v86,45 86.4,45.4 U2.13
  Bottom 0.305: v81,45 v86,45
DCDC_IN
  Top 0.305: Q3.4 44,39 43,40 43,43.5 44.5,45 46,45 46.5,45.5 D2.A 48.38,46.58 Q7.1 | R12.2 61,45 62,44 64.5,44 66,42.5 66,32 65,31 45.46,31 C18.+
  pour Top (no thermals): 28,42 46,42 47,41 47,37 48,36 48,30 47,29 29,29 28,30 28,38 27,39 27,41
DTR
  Top 0.305: C22.1 78.15,75 FTDI.1
FUSE+  (via drill 0.4)
  other vias: 26,7 28,7 29,6 29,4 28,3 26,3 25,4 25,6
  pour Bottom (no thermals): 22.5,3 22.5,18.5 32.5,18.5 32.5,3 31.5,2 23.5,2
  pour Top (no thermals): 22.5,3 23.5,2 31,2 32,3 32,15 31,16 22.5,16
GND  (via drill 0.4)
  Top 0.203: C14.2 68.95,53.9 v69.4,53.9 69.75,53.9 C17.2
  Top 0.254: C21.2 67.9,47.75 v67.9,47.9 68.95,46.85 C19.2
  Top 0.305: C9.2 39.35,67.8 v43.4,67.8 | U4.8 39.85,69.25 39.3,68.7 C9.2 | C9.2 38.4,66.95 38.4,63.75 R6.1 | R8.1 39,19 38.5,18.5 38.5,18 41.3,15.2 41.3,2.7 42.4,1.6 59.6,1.6 61,3 61,21 70.5,30.5 R16.2 | v66,44 65.15,45 C16.2 R13.1 | U1.6 56.48,51.67 C27.2 55.15,52.15 v54.5,51.5 | U1.16 65.17,52.33 C26.2 66.15,53.15 v67.4,51.9 | LED1.K 67.88,68.61 LED3.C | LED2.K 72.88,68.61 LED4.C | R11.1 66,57.45 v66,57 65.35,57 C12.2 | U2.21 91.55,57.4 C23.2 C24.2 94.1,59.06 v94.08,59.08 | U2.5 82.8,56.6 83.1,56.9 83.1,57.7 82.6,58.2 U2.3 | Y1.2 v78,54
  Top 0.406: 42.95,67.95 v43.4,67.8 | U2.3 80.35,58.2 C30.2 79.45,59 v78.8,59 | LED1.K 68.27,71.73 v66,74
  Bottom 0.305: 62,33 70,33
  Bottom 0.406: v66,74 66,76
  other vias: 22.5,35 43.4,66.7 20,27 21,26 22,25 21,27 22,27 22,26 23,25 23,26 23,27 45,7 47,7 48,6 48,4 47,3 45,3 44,4 44,6 41,48.5 42,48.5 22.5,37 22.5,36 22.5,34 26,33 26,34 16.5,33 16.5,34 17.5,33 53,59 53,58
  pour Bottom: 34,81 101,81 101,17 66,17 66,43 59,50 36,50 34,52
  pour Top (no thermals): 27,38 27,29 28,28 47,28 48,27 48,14 50,12 50,3 49.2,2.2 42.8,2.2 42,3 42,15.5 39.5,18 39.5,21.5 38,23 23,23 19,27 17,27 16,28 16,32.7 14,34.7 14,38
  pour Bottom (no thermals): 15.7,27.3 24,19 36,19 42,13 42,3 42.8,2.2 49.2,2.2 50,3 50,12 48,14 48,23 50,25 63,25 65,27 65,33 64,34 57,34 54,37 48,37 47,38 47,48 46,49 34,49 32,47 26,47 24,45 18,45 16,43 15.7,37
  pour Top (no thermals): 42.8,66.5 42.8,70 46.8,70 46.8,67 47.5,66.3 47.5,64.6 44.7,64.6
  pour Top (no thermals): 40,50 45,50 45,47 42,47 42,46 40,46
  pour Top (no thermals): 50,60 53,60 54,59 54,56 52,56 51,57 50,57
HS_DRV
  Top 0.406: R2.1 39,50 39.37,50.37 U3.3
I_DCDC_N
  Top 0.203: U1.19 66.88,54.27 C14.1 68.7,53.15 R16.1 71.5,52.35 71.5,53 71.65,53.15 C15.1
I_DCDC_P
  Top 0.203: U1.20 65.92,54.92 67,56 69.35,56 C17.1 C15.2 73.15,54.85 73.5,54.5 73.5,52.35 R17.1
I_LOAD_N
  Top 0.254: C19.1 70,46.15 70,48 68.28,49.73 U1.12
  Top 0.305: C19.1 69,43.15 C20.1 69,42.85 R18.2
I_LOAD_P
  Top 0.254: C21.1 66,46.15 66,48 64.92,49.08 U1.11
  Top 0.305: C21.1 67,43.15 C20.2 67,42.85 R19.2
LC_OUT  (via drill 0.4)
  Top 0.305: C13.2 R7.1 53,42
  other vias: 61,42 50,39.5 51,39.5 52,39.5 60,42 59,42 62,42 63,36 62,36 61,36 60,36 59,36 63,42 50,43 51,43 52,43 49,39.5
  pour Top (no thermals): 49,38 54,38 57,35 64,35 65,36 65,42.5 64,43.5 49,43.5 48,42.5 48,39
  pour Bottom: 54,38 57,35 64,35 65,36 65,42.5 64,43.5 49,43.5 48,42.5 48,39 49,38
LED1  (via drill 0.4)
  Top 0.305: U1.4 58.23,53 60.3,53 61,53.7 61,63.4 61.6,64 66.85,64 R15.2 67,64.15 67,63 66.5,62.5 66.5,58.8 68.1,57.2 70,57.2 70.5,56.7 v74,56.7 | v81,52 81.4,51.6 83.6,51.6 84,52 U2.10
  Bottom 0.305: v74,56.7 74,54 77,52 v81,52
LED2  (via drill 0.4)
  Top 0.305: v68.5,51 67.88,50.38 U1.13 | R24.2 72.85,63.85 72,63 68,63 67,62 67,59 68,58 70.6,58 v71,57.6 71.4,58 74,58 75,57 75,51 v74.8,51 | v78,51 84.1,51 84.8,51.7 U2.11
  Bottom 0.305: v68.5,51 68.5,55.1 v71,57.6 | v74.8,51 v78,51
LOAD-  (via drill 0.4)
  other vias: 9,7 10,6 10,4 9,3 7,3 6,4 6,6 7,7
  pour Top (no thermals): 4,2 11,2 12,3 12,25 11,26 4,26 3,25 3,3
  pour Bottom (no thermals): 10,2 11,3 11,7 10,8 6,8 5,7 5,3 6,2
LOAD_EN  (via drill 0.4)
  Top 0.305: R23.1 7,32 8,31 8,28 9,27 v14,27 | v49,51 51,51 53.5,48.5 60.5,48.5 61.5,49.5 61.5,51.8 62.67,52.98 U1.17
  Bottom 0.305: v14,27 15,28 15,43 17.5,45.5 24,45.5 26,47.5 31.6,47.5 34.8,50.7 48.7,50.7 v49,51
LOAD_G  (1 unrouted)
  Top 0.305: 3,28.85 3,28 4.5,26.5 6.5,26.5 7.5,25.5 11.5,25.5 12,25 12,19 12.28,18.72 Q5.1
LS_DRV
  Top 0.406: 41.95,46.26 U3.8 41.91,44.91 41,44 R3.1
MISO  (via drill 0.4)
  Top 0.305: OHEX.7 92.54,37 91,37 89,39 89,52.51 U2.16 88.8,53.7 88.4,54.1 88.4,55.4 v88,56 | ICSP_MEGA.1 73.16,70.5 79,70.5 80.2,69.3 v80.2,62.6
  Bottom 0.305: v80.2,62.6 80.8,62 81.3,62 82.1,61.2 82.1,58.8 83.4,57.5 86,57.5 87.5,56 v88,56
MISO_TINY
  Top 0.305: U1.2 59.77,54.27 60,54.5 60,62.4 59,63.4 ICSP_TINY.1
MOSI  (via drill 0.4)
  Top 0.305: v72,73 73.8,71.2 79.8,71.2 81,70 v81,61.1 | OHEX.9 92.73,33.27 88,38 U2.15 88,53.5 87.5,54 v87.5,54.5
  Bottom 0.254: 69.9,76.28 69.9,74.1
  Bottom 0.305: ICSP_MEGA.4 69.9,76.28 | 69.9,74.1 71,73 v72,73 | v81,61.1 81,59 83,57 85.5,57 87,55.5 87,55 v87.5,54.5
N$1
  Top 0.406: R1.1 40.63,53.52 U3.2
N$2
  Top 0.406: R1.2 36.25,54.1 C5.1
N$4  (via drill 0.4)
  Top 0.305: Q1.1 36.09,44.5 v40,44.5 | v41.5,43 43,44.5 43,46 43.58,46.58 D1.A
  Top 0.406: R2.2 34.05,46.08 Q1.1
  Bottom 0.305: v40,44.5 v41.5,43
N$6  (via drill 0.4)
  Top 0.254: 4,29.95 4,28
  Top 0.305: R9.2 21.5,20 22,19.5 v22,19 | 4,28 5,27 7,27 8,26 12,26 14.31,23.69 Q5.3 | v68,31.5 68,37 67,38 R19.1 | 4,29.95 T1.E 2.85,31.05 1.7,32.2 1.7,33.55 R21.1
  Bottom 0.305: v22,19 34.1,19 40.7,12.4 40.7,2.3 42,1 60,1 61.8,2.8 61.8,20.8 68,27 v68,31.5
  pour Top (no thermals): 21,17 21,24 19,26 14,26 13,25 13,19 15,19 17,17
N$8
  Top 0.305: Q3.1 50.03,37 48,37 47.5,37.5 47.5,42 49.5,44 50.5,44 50.8,44.3 Q7.3 52.65,46 R7.2 C13.1
N$9
  Top 0.406: R3.2 26.8,43 25.5,41.7 25.5,39.6 24.9,39 20.4,39 19.72,38.32 Q2.1
N$10
  Top 0.305: D1.C D2.C 47.58,43.42 Q7.2
N$11
  Top 0.305: R22.1 6.2,30.35 R20.1 7,31 6,32 T1.C
N$12
  Top 0.406: R4.2 R14.2 14.7,41.35 C7.2
N$13
  Top 0.305: U4.6 42.33,72.62 L2.1 42.55,72.85 C8.2
N$14
  Top 0.305: U4.7 41.67,70.08 C8.1
N$15
  Top 0.254: Y1.1 79.7,55 U2.7
N$16
  Top 0.305: C9.1 39.45,66 41.3,66 41.67,65.62 U4.2
N$17
  Top 0.254: Y1.3 80.9,52.8 81.7,53.6 U2.8
N$22
  Top 0.305: U4.1 41.02,63.17 R6.2 R5.1
N$24
  Top 0.305: R23.2 6.65,35 R21.2 4.85,33.85 4.5,33.5 3.45,33.5 T1.B
N$43
  Top 0.305: LED1.A 66.12,68.61 LED3.A 66.15,66.97 R15.1
N$46
  Top 0.305: LED2.A 71.12,68.61 LED4.A 71.15,66.97 R24.1
PWM_H  (via drill 0.4)
  Top 0.305: U3.5 38.09,48.41 v37.5,49 | 58.17,51 U1.7 56.52,51.02 56,50.5 v53.5,50.5
  Bottom 0.305: v37.5,49 38.5,50 53,50 v53.5,50.5
PWM_L  (via drill 0.4)
  Top 0.305: U3.6 39.37,48.63 v39,49 | v55,49.5 56,49.5 56.88,50.38 U1.8
  Bottom 0.305: v39,49 39.5,49.5 v55,49.5
RESET  (via drill 0.4)
  Top 0.254: 67.5,76.3 72.44,76.3 | 85.4,75.75 85.4,73.1 85.6,72.9
  Top 0.305: U1.10 60.17,49.08 61,49.9 61,52.2 62,53.2 62,62 v62.4,62.4 | v63,65 63,73.92 ICSP_TINY.5 66.2,75 67.5,76.3 | 72.44,76.3 ICSP_MEGA.5 76.55,77.85 C22.2 77.15,78 R46.1 85.4,75.75 | U2.29 85.6,72.9 85.7,73 93,73 95,71 v95,62 | OHEX.2 96.27,58.23 v95.6,58.9
  Bottom 0.305: v62.4,62.4 62.4,64.4 v63,65 | v95.6,58.9 95.6,61.4 v95,62
RXI  (via drill 0.4)
  Top 0.305: v85.3,59 84.8,59.6 U2.30 84.8,74.28 FTDI.3 | v92,50 92,43 92.8,42.2 94.3,42.2 95,41.5 95,40.1 96.27,38.83 OHEX.6
  Bottom 0.305: v85.3,59 88,59 89,58 89,53 v92,50
SCK  (via drill 0.4)
  Top 0.305: OHEX.5 91.65,38.35 90.29,39.71 U2.17 89.3,54.2 89,54.5 89,56.5 v88,57.5 | ICSP_MEGA.3 74.2,72 80,72 82.1,69.9 v82.1,62.5
  Bottom 0.305: v82.1,62.5 82.8,61.8 82.8,59.2 83.9,58.1 87.4,58.1 v88,57.5
SCL  (via drill 0.4, 0.5)
  Top 0.305: ICSP_TINY.3 59.6,73.06 59.6,63.6 60.5,62.7 60.5,54 60.12,53.62 U1.3 57.17,53.62 56.95,53.85 56.95,55.65 57.85,56.55 R48.1 | v86.7,71 86.4,70.7 U2.28 86.4,58.4 85,57 v85,56 | OHEX.14 94.96,29.5 92.5,29.5 84.3,37.7 v84.3,48
  Bottom 0.305: ICSP_TINY.3 62,74.54 62,73 64,71 v86.7,71 | v85,56 85,49.8 84.3,49.1 v84.3,48
SDA  (via drill 0.4, 0.5)
  Top 0.254: 57.9,76.3 60.3,76.3
  Top 0.305: 59,54.92 59.42,54.92 59.5,55 59.5,62 58,63.5 58,72 57,73 57,75.4 57.9,76.3 | 59,54.92 U1.1 | R45.1 58.8,57.85 58.8,55.12 59,54.92 | 60.3,76.3 ICSP_TINY.4 | v88,72 88,71 87.2,70.2 U2.27 87.2,58.2 86,57 v86,55 | OHEX.16 94.92,27 91,27 82,36 82.2,48.5 83.1,49.4 84.7,49.4 v85.3,48.8
  Bottom 0.305: ICSP_TINY.4 62.8,76.28 62.8,74 64.8,72 v88,72 | v86,55 86,49.5 v85.3,48.8
SOLAR+  (via drill 0.4)
  other vias: 57.5,4 57.5,6 56.5,7 54.5,7 53.5,6 53.5,4 54.5,3 56.5,3 56,23 59,22 56,22 56,21 56,20 56,19 59,20 50,19 50,20 50,21 50,22 50,23 59,6 59,8 59,10 59,12 59,14 59,16 59,18
  pour Top (no thermals): 52,2 51,3 51,12 49,14 49,23 50,24 59,24 60,23 60,3 59,2
  pour Bottom (no thermals): 52,2 51,3 51,12 49,14 49,23 50,24 59,24 60,23 60,3 59,2
SW_NODE  (via drill 0.4)
  Top 0.406: C7.1 21.41,42 Q2.4 | U3.4 36.45,51.7 C5.2 30.7,52.15 L3.P$2
  other vias: 26.5,52.5 26.5,51.5 26.5,50.5 26.5,49.5 27.5,53.5
  pour Top (no thermals): 18,40 26,40 26,43 33,43 33,53 32,54 19,54 18,53
  pour Bottom (no thermals): 27,54 32,54 33,53 33,49 32,48 27,48 26,49 26,53
TXO  (via drill 0.4)
  Top 0.305: v84,59.9 U2.31 84,72.54 FTDI.2 | v91.4,52.6 91,52.2 91,41 92.4,39.6 94.4,39.6 95,39 95,37 96.19,35.81 OHEX.8
  Bottom 0.305: v84,59.9 86.9,59.9 88,61 89,61 90,60 90,54 v91.4,52.6
V_BAT
  Top 0.305: U1.18 62.77,53.62 62.5,53.9 62.5,56 63,56.5 C12.1 R11.2 63.15,58.65 64,59.5 64,59.85 R10.1
V_SOLAR
  Top 0.305: U1.14 62.92,51.02 62,50.1 62,49 63,48 64,48 65,47 C16.1 R13.2 R12.1

### Text on the board
tPlace: Libre Solar / Solarduino | V0.4 (05/2016) | Made in St. Pauli | Design: Martin Jäger / m.jaeger@posteo.de / License: CC BY-SA
tNames: - + | + - | - +
bNames: - | + | + | - | - | +